# Altium schematic sheet Sheet1.SchDoc
size A; SheetNumber: 1; SheetTotal: 1
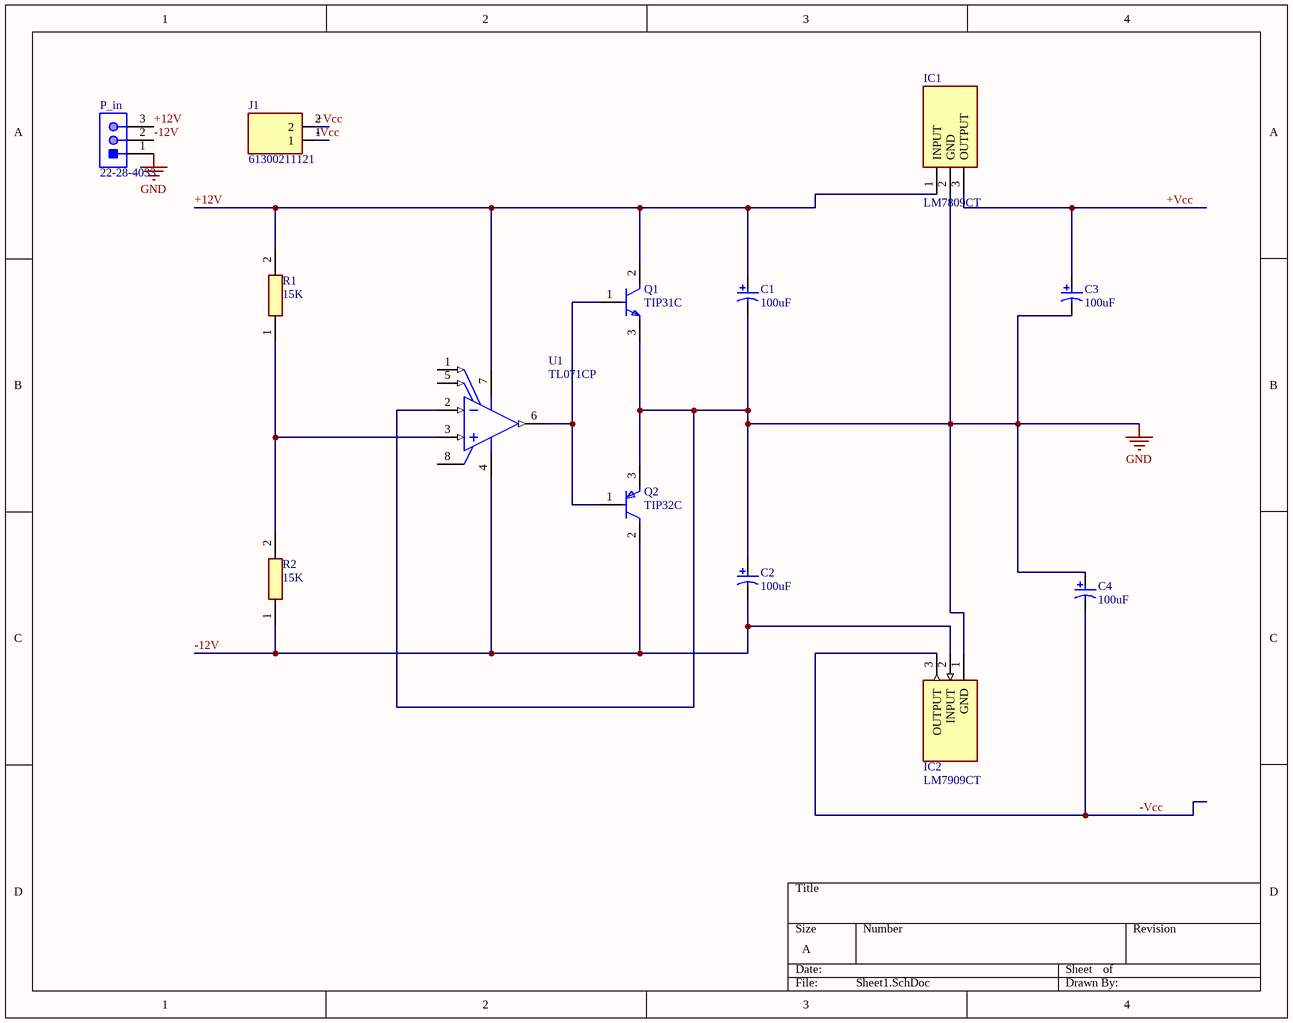
[diagram p0: Sheet1.SchDoc]

## Parts
C1  100uF  [CAPPR65-350-1150X800X1250]
C2  100uF  [CAPPR65-350-1150X800X1250]
C3  100uF  [CAPPR65-350-1150X800X1250]
C4  100uF  [CAPPR65-350-1150X800X1250]
IC1  LM7809CT  [TO254P470X1016X2019-3P]
IC2  LM7909CT  [TO254P483X1016X2261-3P]
J1  61300211121  [HDRV2W110P0X254_1X2_508X254X854P]
P_in  22-28-4033  [MOLX-22-28-4033_V]
Q1  TIP31C  [FP-TO-220-P0A0015988-MFG]
Q2  TIP32C  [FP-TO-220-P0A0015988-MFG]
R1  15K  [RESAD1590W60L630D240]
R2  15K  [RESAD1590W60L630D240]
U1  TL071CP  [P0008A]

## Nets
GND: C1.2 C2.1 C3.2 C4.1 IC1.2(GND) IC2.1(GND) P_in.1 Q1.3(E) Q2.3(E) U1.2(IN-)
+12V: C1.1 IC1.1(INPUT) P_in.3 Q1.2(C) R1.2 U1.7(VCC+)
+Vcc: C3.1 IC1.3(OUTPUT) J1.2
-12V: C2.2 IC2.2(INPUT) P_in.2 Q2.2(C) R2.1 U1.4(VCC-)
-Vcc: C4.2 IC2.3(OUTPUT) J1.1
NetQ1_1: Q1.1(B) Q2.1(B) U1.6(OUT)
NetR1_1: R1.1 R2.2 U1.3(IN+)

Not connected (* = marked no-connect by the designer): U1 1(OFFSET_N1) 5(OFFSET_N2) 8(NC)

## Library data of the parts
C1-C4 = CMP-1665-00042-2: Aluminum Electrolytic Capacitor, 100 uF, +/- 20%, 50 V, -40 to 85 degC, 2-Pin THD, RoHS, Bulk; Manufacturer: Panasonic; Lead Diameter: 0.6mm; Dielectric Material: Aluminium; Voltage Rating (DC): 50V; Ripple Current (AC): 250mA; Polarity: Polar; Leakage Current: 3uA; Life (Hours): 2000Hour; Lead/Base Style: Straight; Dissipation Factor: 0.12%; Radiation Hardening: No; Height: 11.5mm; Package Quantity: 200; Package Reference: CAPPR65-350-1150X800X1250; Min Operating Temperature: -40degC; Mount: ThroughHole; Package Description: 2-Pin Radial Lead, Dia 8 mm, Height 12.5 mm; Case/Package: Radial; Diameter: 8mm; Voltage Rating: 50V; Length: 11.5mm; REACH SVHC: NoSVHC; Height - Seated (Max): 0.492inch; Datasheet URL: https://industrial.panasonic.com/cdbs/www-data/pdf/RDF0000/ABA0000C1218.pdf; RoHSCompliant: true; Ripple Current: 250mA; Lead Free: LeadFree; Voltage: 50V; Manufacturer URL: http://www.panasonic.com/; Number of Pins: 2; Datasheet Version: Rev. 05, 10/2016; Packaging: Bulk; Termination: Radial; Max Operating Temperature: 85degC; Tolerance: 20%; Capacitance: 100uF; Lead Pitch: 3.5mm
IC1 = LM7809CT: Power Supply; Manufacturer_Name: onsemi; Datasheet Link: https://mouser.componentsearchengine.com/Datasheets/2/LM7809CT.pdf; Height: 4.7mm; Manufacturer_Part_Number: LM7809CT; Mouser Part Number: 512-LM7809CT; Mouser Price/Stock: https://www.mouser.co.uk/ProductDetail/ON-Semiconductor-Fairchild/LM7809CT?qs=VOMQJJE%252BBNmmTueoZonUjQ%3D%3D; Arrow Part Number: LM7809CT; Arrow Price/Stock: https://www.arrow.com/en/products/lm7809ct/on-semiconductor?region=europe
IC2 = LM7909CT: Integrated Circuit; Manufacturer_Name: onsemi; Datasheet Link: https://datasheet.datasheetarchive.com/originals/distributors/Datasheets_SAMA/07f7f5cfa7b45aeaa7d93e4c14459954.pdf; Height: 4.83mm; Manufacturer_Part_Number: LM7909CT; Mouser Part Number: 512-LM7909CT; Mouser Price/Stock: https://www.mouser.co.uk/ProductDetail/ON-Semiconductor-Fairchild/LM7909CT?qs=AxPfoIcMNKJqxR53dQXLqg%3D%3D; Arrow Part Number: LM7909CT; Arrow Price/Stock: https://www.arrow.com/en/products/lm7909ct/on-semiconductor
J1 = 61300211121: Connector; Manufacturer_Name: Wurth Elektronik; Datasheet Link: https://componentsearchengine.com/Datasheets/2/61300211121.pdf; Height: 8.54mm; Manufacturer_Part_Number: 61300211121; Mouser Part Number: 710-61300211121; Mouser Price/Stock: https://www.mouser.co.uk/ProductDetail/Wurth-Elektronik/61300211121?qs=t4813l51qx%252B1A5GYDQxPlw%3D%3D
P_in = CMP-1676-00001-5: Male Header, Pitch 2.54 mm, 1 x 3 Position, Height 8.38 mm, Tail Length 3.18 mm, RoHS, Bulk; Manufacturer: Molex; Rows: 1; Voltage Rating: 250 V; Current Rating: 4 A; Min Operating Temperature: 0 degC; Lead Pitch: 0.1 inch; Packaging: Bulk; Contact Finish: Gold; RoHSCompliant: true; Contact Material: Brass; PackageReference: 22-28-4033; REACH SVHC: Unknown; PackageDescription: Male Header, Pitch 2.54 mm, 1 x 3 Position, Height 8.38 mm, Tail Length 3.18 mm; ComponentLink2URL: http://www.molex.com/pdm_docs/sd/022284033_sd.pdf; Height: 8.38 mm; Mounting Technology: Through Hole; ComponentLink1Description: Manufacturer URL; Length: 7.62 mm; Mount: Through Hole; DatasheetVersion: Rev. G, 01/2012; Max Operating Temperature: 75 degC; ComponentLink2Description: Datasheet; Colour: Black; Pins: 3; Contact Plating: Gold; Package Quantity: 1; ComponentLink1URL: http://www.molex.com/
Q1 = CMP-12195-000001-1: TRANS NPN 100V 3A TO-220; Manufacturer: STMicroelectronics; Hfe Max: 50; Number Of Npn: 1; Max Junction Temp: +150°C; Standoff Height: 3.5mm; Emitter Base Voltage: 5V; Collector Emitter Saturation Voltage: 1.2V; Power Dissipation: 2W; Hfe Testvce: 4V; Hfe Min: 10; Device Class L2: Transistors; ComponentLink2URL: https://www.st.com/resource/en/datasheet/tip31c.pdf; Device Class L1: Discrete Semiconductors; Digikey Description: TRANS NPN 100V 3A TO-220; Max Collector Current: 3A; RoHS: TRUE; Height: 19.68mm; Mouser Description: Bipolar Transistors - BJT NPN Gen Pur Power; Number Of Elements: 1; Package: TO-220-P0A0015988; Temperature: to +150°C; Octopart: https://octopart.com/tip31c-stmicroelectronics-15555; Manufacturer Part Number: TIP31C; Category: Trans; Hfe Testic: 3A; Lead Free: Yes; Collector Base Voltage: 100V; Device Class L3: BJTs; Collector Emitter Voltage: 100V; Automotive: No; ComponentLink2Description: Datasheet; Temperature Range High: +150°C
Q2 = CMP-12195-000005-1: TRANS PNP 100V 3A TO-220; Manufacturer: STMicroelectronics; Standoff Height: 3.5mm; Number Of Pnp: 1; Max Collector Current: -3A; Emitter Base Voltage: -5V; Collector Emitter Voltage: -100V; Hfe Testvce: -4V; Hfe Max: 50; Collector Emitter Saturation Voltage: -1.2V; Power Dissipation: 2W; Max Junction Temp: +150°C; Hfe Min: 10; Device Class L3: BJTs; Mouser Description: Original ST Microelectronics Transistor, 100V, 3A, .22 Ohm, TO-220 Package; ComponentLink2Description: Datasheet; Device Class L1: Discrete Semiconductors; Automotive: No; Number Of Elements: 1; Category: Trans; Collector Base Voltage: -100V; Package: TO-220-P0A0015988; Height: 19.68mm; Lead Free: Yes; ComponentLink2URL: https://www.st.com/resource/en/datasheet/tip32c.pdf; Hfe Testic: -3A; RoHS: TRUE; Temperature Range High: +150°C; Temperature: to +150°C; Device Class L2: Transistors; Digikey Description: TRANS PNP 100V 3A TO-220; Octopart: https://octopart.com/tip32c-stmicroelectronics-353617; Manufacturer Part Number: TIP32C
R1 R2 = CFR-25JB-52-15K: Resistor; Manufacturer_Name: KEMET; Datasheet Link: https://componentsearchengine.com/Datasheets/1/CFR-25JB-52-15K.pdf; Manufacturer_Part_Number: CFR-25JB-52-15K; Mouser Part Number: 603-CFR-25JB-52-15K; Mouser Price/Stock: https://www.mouser.com/Search/Refine.aspx?Keyword=603-CFR-25JB-52-15K
U1 = CMP-0017-00972-2: Low-Noise JFET-Input General-Purpose Operational Amplifier, 7 to 36 V, 0 to 70 degC, 8-pin DIP (P8), Pb-Free (RoHS); Manufacturer: Texas Instruments; Total Supply Voltage(Min)(+5V is 5, +/-5V is 10): 7; Iq per channel(Max)(mA): 2.5; GBW(Typ)(MHz): 3; Vio (25C)(Max)(mV): 10; CMRR(Min)(dB): 70; Rating: Military; Vn at 1kHz(Typ)(nV/rtHz): 18; IIB(Max)(pA): 200; Number of Channels: 1; Sub Family: General Purpose Amplifier, High Supply Voltage Amplifier (>=30V); Total Supply Voltage(Max)(+5V is 5, +/-5V is 10): 36; Slew Rate(Typ)(V/us): 13; ComponentLink1Description: Manufacturer URL; PackageReference: P0008A; ComponentLink3Description: Package Specification; ComponentLink3URL: http://www.ti.com/litv/pdf/mpdi001b; Mounting Technology: Through Hole; ComponentLink2Description: Datasheet; ComponentLink2URL: http://www.ti.com/lit/ds/symlink/tl071.pdf; PartNumber: TL071CP; Eco-Plan: Pb-Free (RoHS); Offset Drift(Typ)(uV/C): 18; Code_JEDEC: MS-001; DatasheetVersion: SLOS080J; PackageVersion: 4040082/E, 04/2010; PackageDescription: 8-Pin Plastic In-Line, Body 9.59 x 6.35 mm, Pitch 2.54 mm; ComponentLink1URL: http://www.ti.com/